# Altium schematic sheet Copy+of+WX0.011.781DL.schdoc
size A2
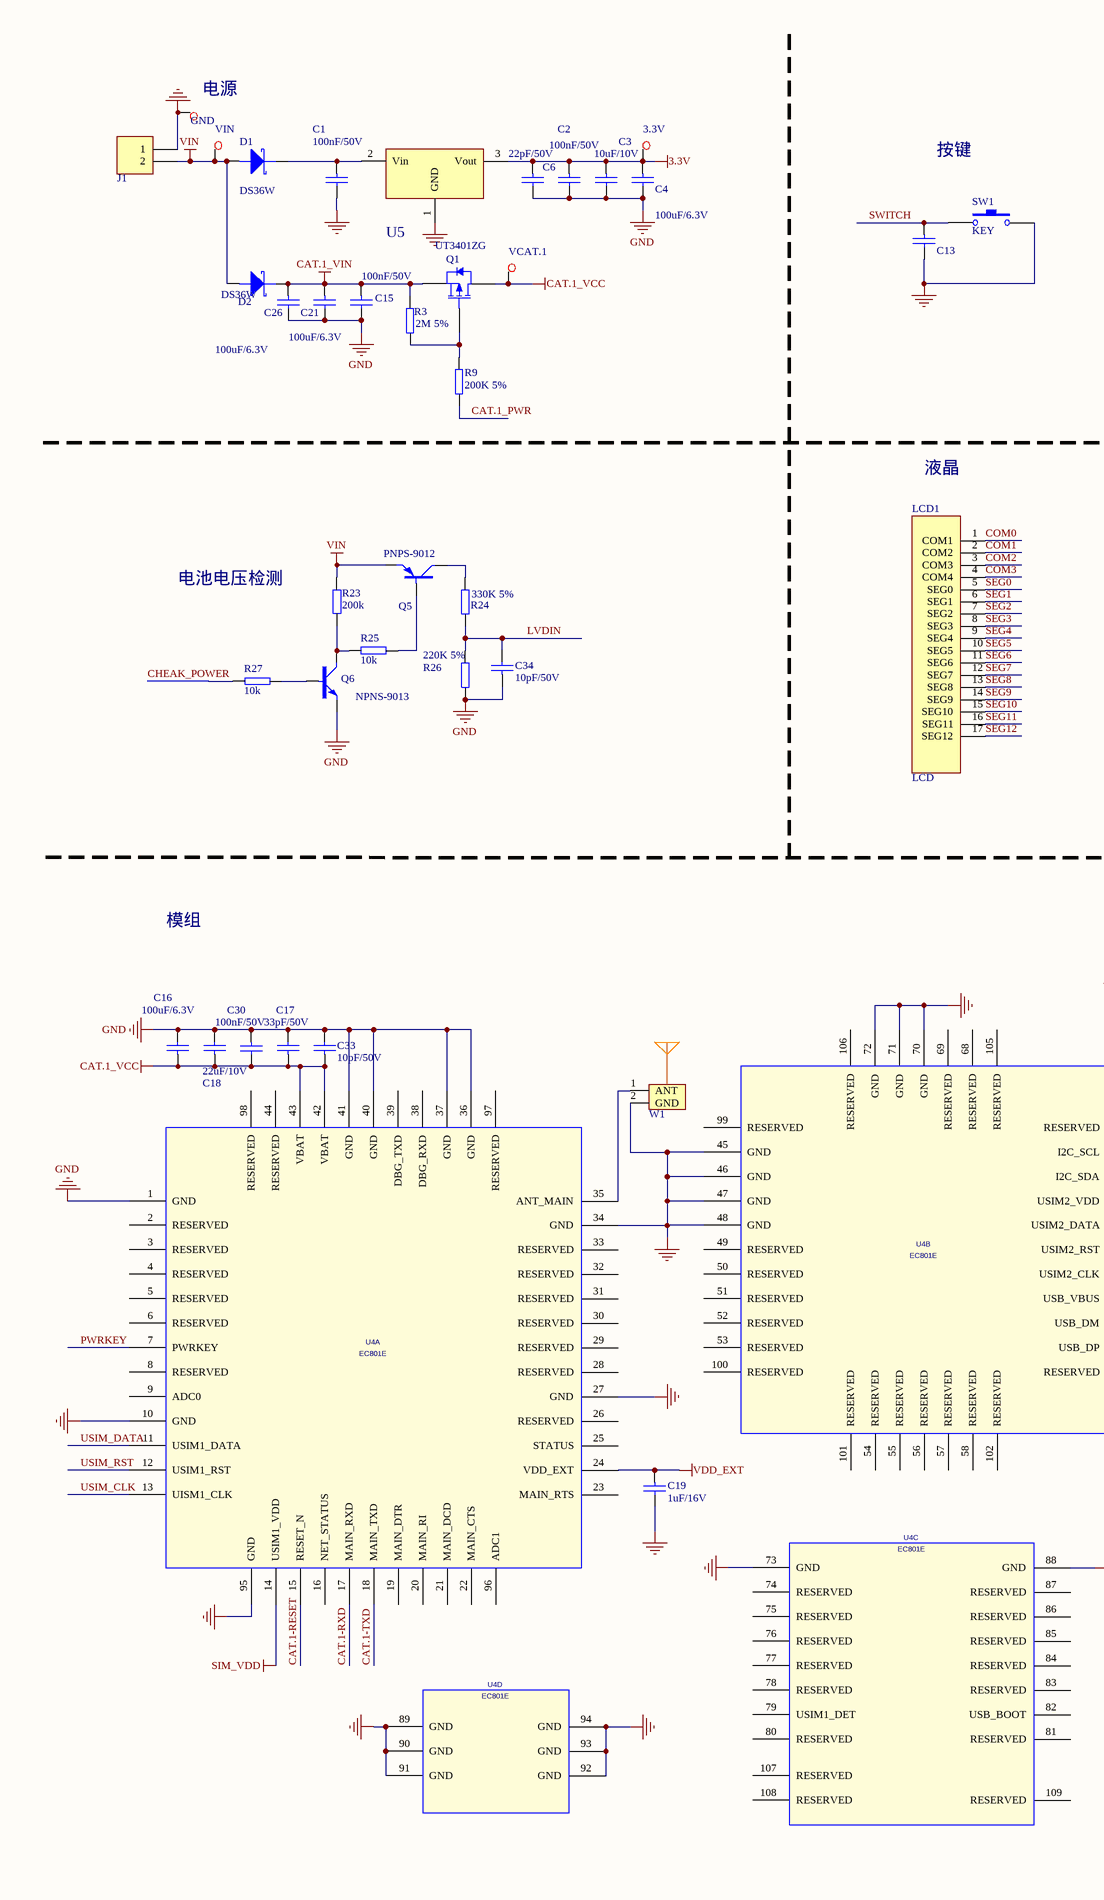
[diagram p0: Copy+of+WX0.011.781DL.schdoc, left]
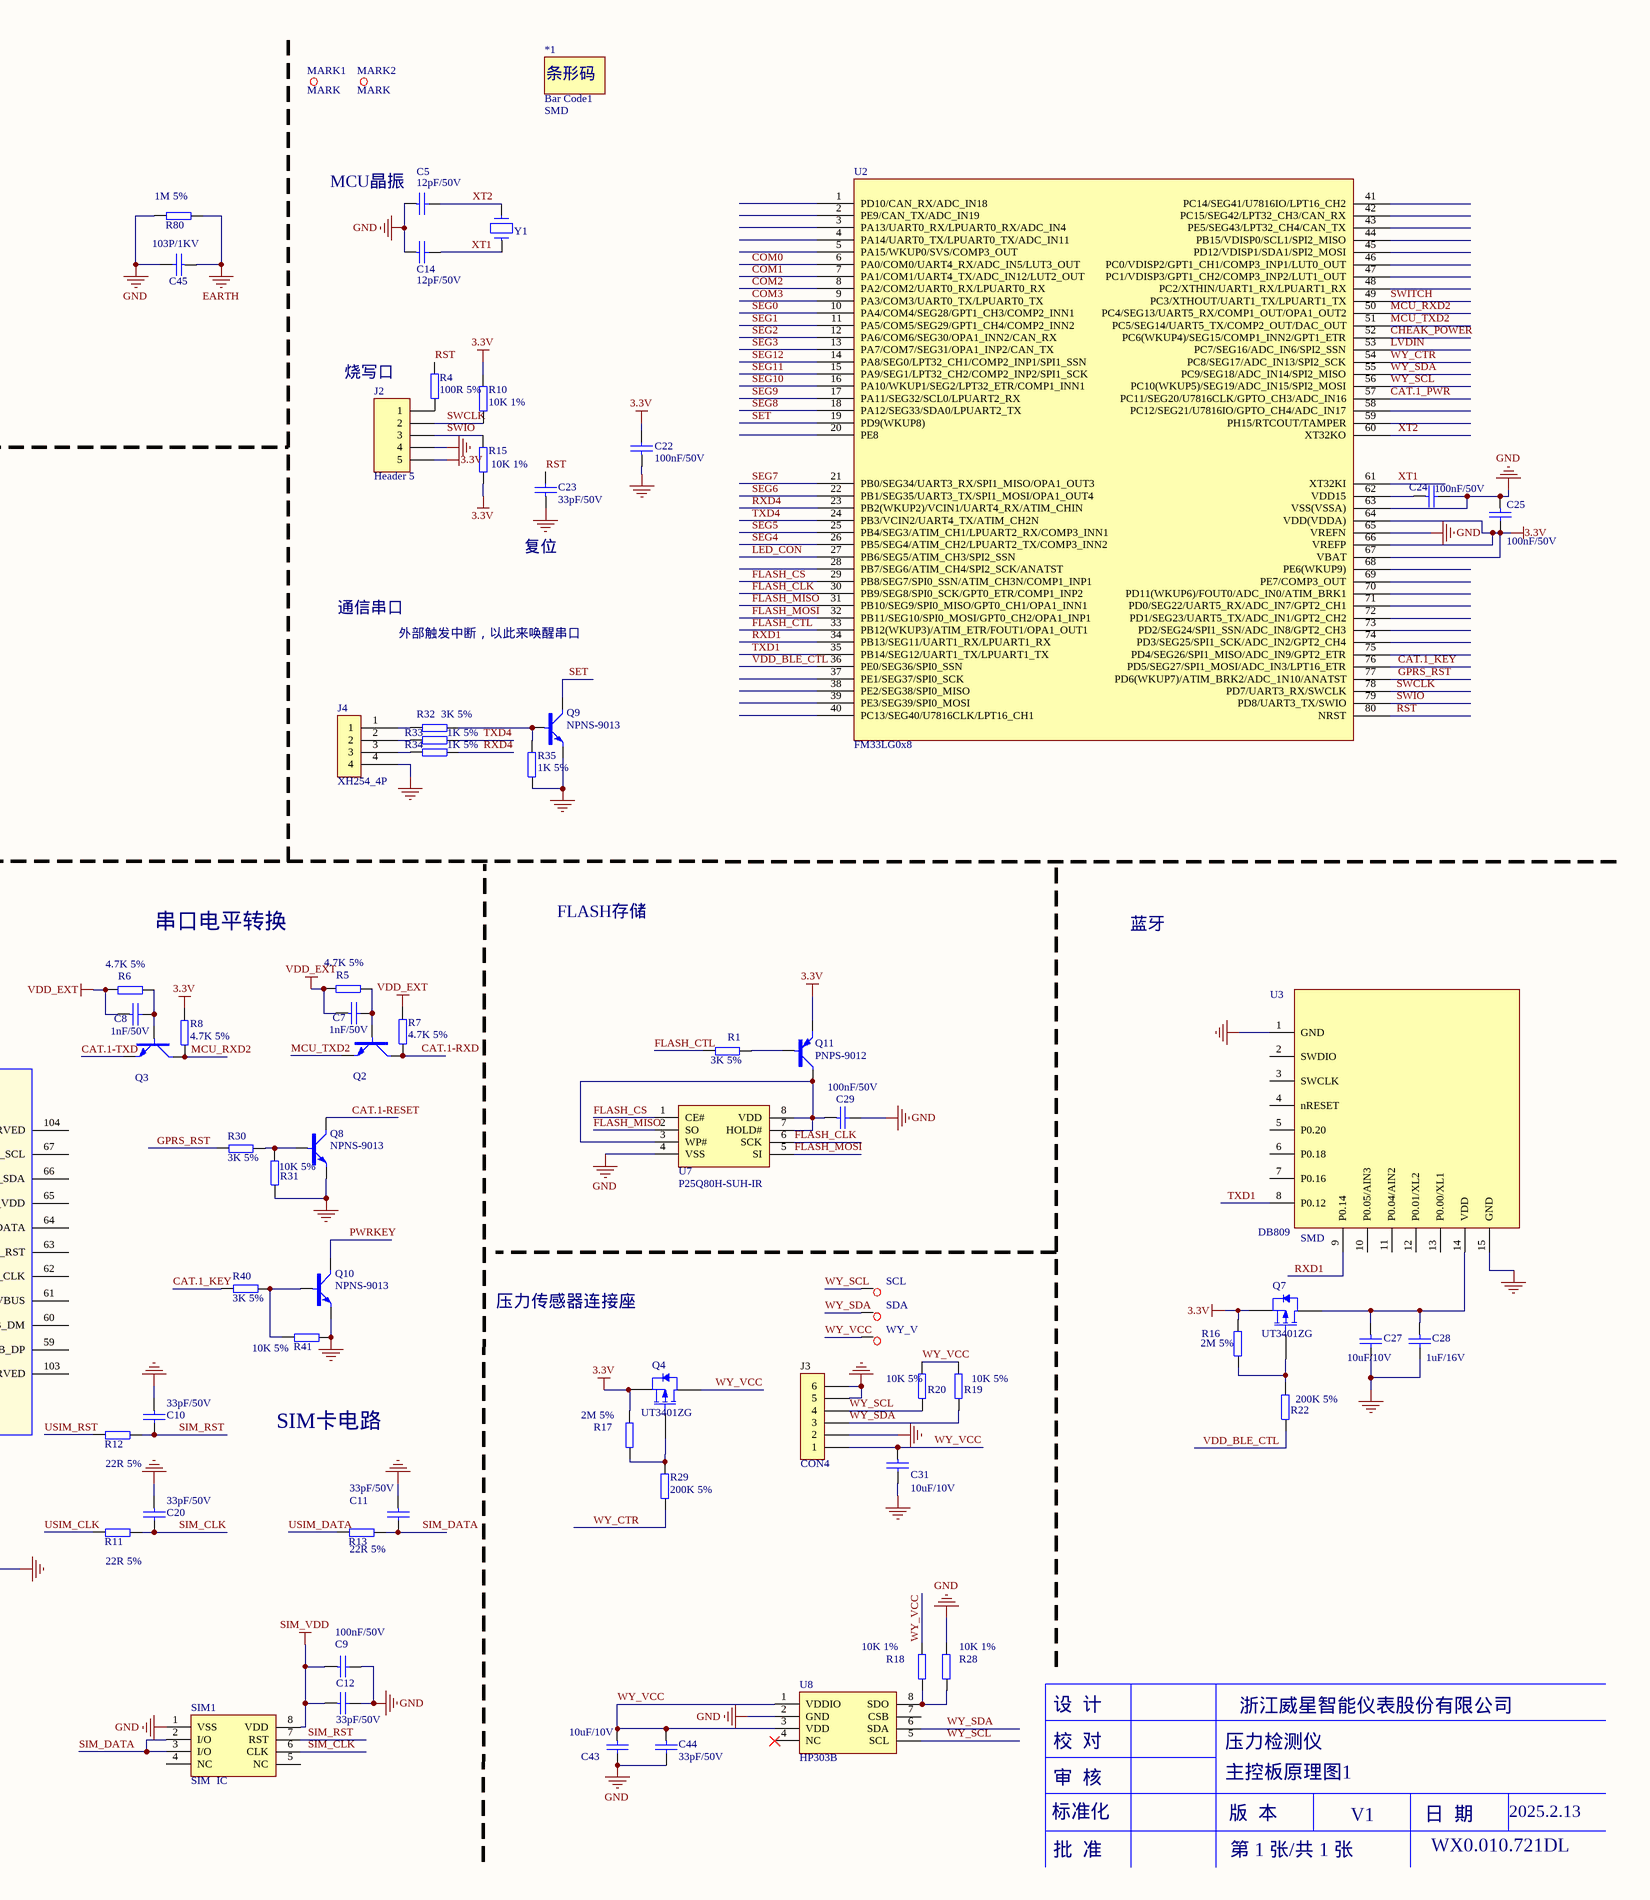
[diagram p1: Copy+of+WX0.011.781DL.schdoc, right]

## Parts
3.3V  TEST-PAD  [TEST-PAD]  (value not drawn)
*1  Bar Code1  SMD/DIP: SMD  [Bar Code1]
C1  100nF/50V  [CAP0603]
C2  100nF/50V  [CAP0603]
C3  10uF/10V  [CAP0603]
C4  100uF/6.3V  [GRM1206]
C5  12pF/50V  [CAP0603]
C6  22pF/50V  [CAP0603]
C7  1nF/50V  [CAP0603]
C8  1nF/50V  [CAP0603]
C9  100nF/50V  [CAP0603]
C10  33pF/50V  [CAP0603]
C11  33pF/50V  [CAP0603]
C12  33pF/50V  [CAP0603]
C13  100nF/50V  [CAP0603]  (value not drawn)
C14  12pF/50V  [CAP0603]
C15  100nF/50V  [CAP0603]
C16  100uF/6.3V  [GRM1206]
C17  33pF/50V  [CAP0603]
C18  22uF/10V  [CAP0805]
C19  1uF/16V  [CAP0603]
C20  33pF/50V  [CAP0603]
C21  100uF/6.3V  [GRM1206]
C22  100nF/50V  [CAP0603]
C23  33pF/50V  [CAP0603]
C24  100nF/50V  [CAP0603]
C25  100nF/50V  [CAP0603]
C26  100uF/6.3V  [GRM1206]
C27  10uF/10V  [CAP0603]
C28  1uF/16V  [CAP0603]
C29  100nF/50V  [CAP0603]
C30  100nF/50V  [CAP0603]
C31  10uF/10V  [CAP0603]
C33  10pF/50V  [CAP0603]
C34  10pF/50V  [CAP0603]
C43  10uF/10V  [CAP0603]
C44  33pF/50V  [CAP0603]
C45  103P/1KV  [CAP1206]
D1  DS36W  [SOD-123FL]
D2  DS36W  [SOD-123FL]
GND  TEST-PAD  [TEST-PAD]  (value not drawn)
J1  Header 2  [VBAT]  (value not drawn)
J2  Header 5  [PIN254_1*5SR]
J3  CON4  [WX-PH-4AB]
J4  XH254_4P  [HDR1X4_2.54]
LCD1  LCD  [JR-H25903AFP]
MARK1  MARK  [MARK]
MARK2  MARK  [MARK]
Q1  UT3401ZG  [SOT-23]
Q2  NPNS-9013  [SOT-23]  (value not drawn)
Q3  NPNS-9013  [SOT-23]  (value not drawn)
Q4  UT3401ZG  [SOT-23]
Q5  PNPS-9012  [SOT-23]
Q6  NPNS-9013  [SOT-23]
Q7  UT3401ZG  [SOT-23]
Q8  NPNS-9013  [SOT-23]
Q9  NPNS-9013  [SOT-23]
Q10  NPNS-9013  [SOT-23]
Q11  PNPS-9012  [SOT-23]
R1  3K 5%  [RES0603]
R3  2M 5%  [RES0603]
R4  100R 5%  [RES0603]
R5  4.7K 5%  [RES0603]
R6  4.7K 5%  [RES0603]
R7  4.7K 5%  [RES0603]
R8  4.7K 5%  [RES0603]
R9  200K 5%  [RES0603]
R10  10K 1%  [RES0603]
R11  22R 5%  [RES0603]
R12  22R 5%  [RES0603]
R13  22R 5%  [RES0603]
R15  10K 1%  [RES0603]
R16  2M 5%  [RES0603]
R17  2M 5%  [RES0603]
R18  10K 1%  [RES0603]
R19  10K 5%  [RES0603]
R20  10K 5%  [RES0603]
R22  200K 5%  [RES0603]
R23  200k  [RES0603]
R24  330K 5%  [RES0603]
R25  10k  [RES0603]
R26  220K 5%  [RES0603]
R27  10k  [RES0603]
R28  10K 1%  [RES0603]
R29  200K 5%  [RES0603]
R30  3K 5%  [RES0603]
R31  10K 5%  [RES0603]
R32  3K 5%  [RES0603]
R33  1K 5%  [RES0603]
R34  1K 5%  [RES0603]
R35  1K 5%  [RES0603]
R40  3K 5%  [RES0603]
R41  10K 5%  [RES0603]
R80  1M 5%  [RES1206]
SCL  TEST-PAD  [TEST-PAD]  (value not drawn)
SDA  TEST-PAD  [TEST-PAD]  (value not drawn)
SIM1  SIM  IC  [SIMIC]
SW1  KEY  [DIP-6X6X8]
U2  FM33LG0x8  [LQFP80]
U3  DB809  SMD/DIP: SMD  [DB809]
U4  EC801E  [EC801E]  (parts A,B,C,D of 4)
U5  CE6232A33P  [SOT-89]  (value not drawn)
U7  P25Q80H-SUH-IR  [SOP-8L-200MIL]
U8  HP303B  [LGA_8]
VCAT.1  TEST-PAD  [TEST-PAD]  (value not drawn)
VIN  TEST-PAD  [TEST-PAD]  (value not drawn)
W1  天线  [ANT-IPEX_1]  (value not drawn)
WY_V  TEST-PAD  [TEST-PAD]  (value not drawn)
Y1  SF32WK32768D71T005  [SMD-3215_2P]  (value not drawn)

## Nets
3.3V: 3.3V.1 C2.1 C3.1 C4.1 C6.1 C22.2 C25.2 J2.5 Q4.2(S) Q7.2(S) Q11.2(E) R8.2 R10.2 R15.1 R16.2 R17.2 U2.64(VDD(VDDA)) U2.66(VREFP) U2.67(VBAT) U5.3(Vout)
CAT.1_VCC: C16.1 C17.1 C18.1 C30.2 C33.1 Q1.3(D) U4.42(VBAT) U4.43(VBAT) VCAT.1.1
CAT.1_VIN: C15.1 C21.1 C26.1 D2.2 Q1.2(S) R3.2
EARTH: C45.1 R80.2
GND: C1.2 C2.2 C3.2 C4.2 C5.1 C6.2 C9.2 C10.1 C11.1 C12.2 C13.2 C14.1 C15.2 C16.2 C17.2 C18.2 C19.2 C20.1 C21.2 C22.1 C23.1 C24.2 C25.1 C26.2 C27.2 C28.2 C29.2 C30.1 C31.2 C33.2 C34.1 C43.2 C44.2 C45.2 GND.1 J1.1 J2.4 J3.2 J3.5 J3.6 J4.4 Q6.2(E) Q8.2(E) Q9.2(E) Q10.2(E) R26.1 R28.2 R31.1 R35.1 R41.2 R80.1 SIM1.1(VSS) SW1.2 U2.63(VSS(VSSA)) U2.65(VREFN) U3.1(GND) U3.15(GND) U4.1(GND) U4.10(GND) U4.27(GND) U4.34(GND) U4.36(GND) U4.37(GND) U4.40(GND) U4.41(GND) U4.45(GND) U4.46(GND) U4.47(GND) U4.48(GND) U4.70(GND) U4.71(GND) U4.72(GND) U4.73(GND) U4.88(GND) U4.89(GND) U4.90(GND) U4.91(GND) U4.92(GND) U4.93(GND) U4.94(GND) U4.95(GND) U5.1(GND) U7.4(VSS) U8.2(GND) W1.2(GND)
SIM_VDD: C9.1 C12.1 SIM1.8(VDD) U4.14(USIM1_VDD)
VDD_EXT: C7.1 C8.1 C19.1 R5.1 R6.1 R7.2 U4.24(VDD_EXT)
VIN: D1.1 D2.1 J1.2 Q5.2(E) R23.2 VIN.1
CAT.1-RESET: Q8.3(C) U4.15(RESET_N)
CAT.1-RXD: Q2.3(C) R7.1 U4.17(MAIN_RXD)
CAT.1-TXD: Q3.2(E) U4.18(MAIN_TXD)
CAT.1_KEY: R40.1 U2.76(PD5/SEG27/SPI1_MOSI/ADC_IN3/LPT16_ETR)
CAT.1_PWR: R9.1 U2.57(PC11/SEG20/U7816CLK/GPTO_CH3/ADC_IN16)
CHEAK_POWER: R27.1 U2.52(PC6(WKUP4)/SEG15/COMP1_INN2/GPT1_ETR)
COM0: LCD1.1(COM1) U2.6(PA0/COM0/UART4_RX/ADC_IN5/LUT3_OUT)
COM1: LCD1.2(COM2) U2.7(PA1/COM1/UART4_TX/ADC_IN12/LUT2_OUT)
COM2: LCD1.3(COM3) U2.8(PA2/COM2/UART0_RX/LPUART0_RX)
COM3: LCD1.4(COM4) U2.9(PA3/COM3/UART0_TX/LPUART0_TX)
FLASH_CLK: U2.30(PB9/SEG8/SPI0_SCK/GPT0_ETR/COMP1_INP2) U7.6(SCK)
FLASH_CS: U2.29(PB8/SEG7/SPI0_SSN/ATIM_CH3N/COMP1_INP1) U7.1(CE#)
FLASH_CTL: R1.1 U2.33(PB12(WKUP3)/ATIM_ETR/FOUT1/OPA1_OUT1)
FLASH_MISO: U2.31(PB10/SEG9/SPI0_MISO/GPT0_CH1/OPA1_INN1) U7.2(SO)
FLASH_MOSI: U2.32(PB11/SEG10/SPI0_MOSI/GPT0_CH2/OPA1_INP1) U7.5(SI)
GPRS_RST: R30.1 U2.77(PD6(WKUP7)/ATIM_BRK2/ADC_1N10/ANATST)
LED_CON: U2.27(PB6/SEG5/ATIM_CH3/SPI2_SSN)
LVDIN: C34.2 R24.1 R26.2 U2.53(PC7/SEG16/ADC_IN6/SPI2_SSN)
MCU_RXD2: Q3.3(C) R8.1 U2.50(PC4/SEG13/UART5_RX/COMP1_OUT/OPA1_OUT2)
MCU_TXD2: Q2.2(E) U2.51(PC5/SEG14/UART5_TX/COMP2_OUT/DAC_OUT)
PWRKEY: Q10.3(C) U4.7(PWRKEY)
RST: C23.2 R4.1 U2.80(NRST)
RXD1: U2.34(PB13/SEG11/UART1_RX/LPUART1_RX) U3.9(P0.14)
RXD4: R34.2 U2.23(PB2(WKUP2)/VCIN1/UART4_RX/ATIM_CHIN)
SEG0: LCD1.5(SEG0) U2.10(PA4/COM4/SEG28/GPT1_CH3/COMP2_INN1)
SEG1: LCD1.6(SEG1) U2.11(PA5/COM5/SEG29/GPT1_CH4/COMP2_INN2)
SEG2: LCD1.7(SEG2) U2.12(PA6/COM6/SEG30/OPA1_INN2/CAN_RX)
SEG3: LCD1.8(SEG3) U2.13(PA7/COM7/SEG31/OPA1_INP2/CAN_TX)
SEG4: LCD1.9(SEG4) U2.26(PB5/SEG4/ATIM_CH2/LPUART2_TX/COMP3_INN2)
SEG5: LCD1.10(SEG5) U2.25(PB4/SEG3/ATIM_CH1/LPUART2_RX/COMP3_INN1)
SEG6: LCD1.11(SEG6) U2.22(PB1/SEG35/UART3_TX/SPI1_MOSI/OPA1_OUT4)
SEG7: LCD1.12(SEG7) U2.21(PB0/SEG34/UART3_RX/SPI1_MISO/OPA1_OUT3)
SEG8: LCD1.13(SEG8) U2.18(PA12/SEG33/SDA0/LPUART2_TX)
SEG9: LCD1.14(SEG9) U2.17(PA11/SEG32/SCL0/LPUART2_RX)
SEG10: LCD1.15(SEG10) U2.16(PA10/WKUP1/SEG2/LPT32_ETR/COMP1_INN1)
SEG11: LCD1.16(SEG11) U2.15(PA9/SEG1/LPT32_CH2/COMP2_INP2/SPI1_SCK)
SEG12: LCD1.17(SEG12) U2.14(PA8/SEG0/LPT32_CH1/COMP2_INP1/SPI1_SSN)
SET: Q9.3(C) U2.19(PD9(WKUP8))
SIM_CLK: C20.2 R11.2 SIM1.6(CLK)
SIM_DATA: C11.2 R13.2 SIM1.2(I/O) SIM1.3(I/O)
SIM_RST: C10.2 R12.2 SIM1.7(RST)
SWCLK: J2.2 R10.1 U2.78(PD7/UART3_RX/SWCLK)
SWIO: J2.3 R15.2 U2.79(PD8/UART3_TX/SWIO)
SWITCH: C13.1 SW1.1 U2.49(PC3/XTHOUT/UART1_TX/LPUART1_TX)
TXD1: U2.35(PB14/SEG12/UART1_TX/LPUART1_TX) U3.8(P0.12)
TXD4: R33.2 U2.24(PB3/VCIN2/UART4_TX/ATIM_CH2N)
USIM_CLK: R11.1 U4.13(UISM1_CLK)
USIM_DATA: R13.1 U4.11(USIM1_DATA)
USIM_RST: R12.1 U4.12(USIM1_RST)
VDD_BLE_CTL: R22.1 U2.36(PE0/SEG36/SPI0_SSN)
WY_CTR: R29.1 U2.54(PC8/SEG17/ADC_IN13/SPI2_SCK)
WY_SCL: J3.4 R20.1 SCL.1 U2.56(PC10(WKUP5)/SEG19/ADC_IN15/SPI2_MOSI) U8.5(SCL)
WY_SDA: J3.3 R19.1 SDA.1 U2.55(PC9/SEG18/ADC_IN14/SPI2_MISO) U8.6(SDA)
WY_VCC: C31.1 C43.1 C44.1 J3.1 Q4.3(D) R18.2 R19.2 R20.2 U8.1(VDDIO) U8.3(VDD) WY_V.1
XT1: C14.2 U2.61(XT32KI) Y1.1
XT2: C5.2 U2.60(XT32KO) Y1.2
NetC1_1: C1.1 D1.2 U5.2(Vin)
NetC7_2: C7.2 Q2.1(B) R5.2
NetC8_2: C8.2 Q3.1(B) R6.2
NetC24_1: C24.1 U2.62(VDD15)
NetC27_1: C27.1 C28.1 Q7.3(D) U3.14(VDD)
NetC29_1: C29.1 Q11.3(C) U7.3(WP#) U7.7(HOLD#) U7.8(VDD)
NetJ2_1: J2.1 R4.2
NetJ4_1: J4.1 R32.1
NetJ4_2: J4.2 R33.1
NetJ4_3: J4.3 R34.1
NetQ1_1: Q1.1(G) R3.1 R9.2
NetQ4_1: Q4.1(G) R17.1 R29.2
NetQ5_1: Q5.1(B) R25.2
NetQ5_3: Q5.3(C) R24.2
NetQ6_1: Q6.1(B) R27.2
NetQ6_3: Q6.3(C) R23.1 R25.1
NetQ7_1: Q7.1(G) R16.1 R22.2
NetQ8_1: Q8.1(B) R30.2 R31.2
NetQ9_1: Q9.1(B) R32.2 R35.2
NetQ10_1: Q10.1(B) R40.2 R41.1
NetQ11_1: Q11.1(B) R1.2
NetR18_1: R18.1 R28.1 U8.8(SDO)
NetU4_35: U4.35(ANT_MAIN) W1.1(ANT)

Not connected (* = marked no-connect by the designer): SIM1 4(NC) 5(NC); U2 1(PD10/CAN_RX/ADC_IN18) 2(PE9/CAN_TX/ADC_IN19) 3(PA13/UART0_RX/LPUART0_RX/ADC_IN4) 4(PA14/UART0_TX/LPUART0_TX/ADC_IN11) 5(PA15/WKUP0/SVS/COMP3_OUT) 20(PE8) 28(PB7/SEG6/ATIM_CH4/SPI2_SCK/ANATST) 37(PE1/SEG37/SPI0_SCK) 38(PE2/SEG38/SPI0_MISO) 39(PE3/SEG39/SPI0_MOSI) 40(PC13/SEG40/U7816CLK/LPT16_CH1) 41(PC14/SEG41/U7816IO/LPT16_CH2) 42(PC15/SEG42/LPT32_CH3/CAN_RX) 43(PE5/SEG43/LPT32_CH4/CAN_TX) 44(PB15/VDISP0/SCL1/SPI2_MISO) 45(PD12/VDISP1/SDA1/SPI2_MOSI) 46(PC0/VDISP2/GPT1_CH1/COMP3_INP1/LUT0_OUT) 47(PC1/VDISP3/GPT1_CH2/COMP3_INP2/LUT1_OUT) 48(PC2/XTHIN/UART1_RX/LPUART1_RX) 58(PC12/SEG21/U7816IO/GPTO_CH4/ADC_IN17) 59(PH15/RTCOUT/TAMPER) 68(PE6(WKUP9)) 69(PE7/COMP3_OUT) 70(PD11(WKUP6)/FOUT0/ADC_IN0/ATIM_BRK1) 71(PD0/SEG22/UART5_RX/ADC_IN7/GPT2_CH1) 72(PD1/SEG23/UART5_TX/ADC_IN1/GPT2_CH2) 73(PD2/SEG24/SPI1_SSN/ADC_IN8/GPT2_CH3) 74(PD3/SEG25/SPI1_SCK/ADC_IN2/GPT2_CH4) 75(PD4/SEG26/SPI1_MISO/ADC_IN9/GPT2_ETR); U3 2(SWDIO) 3(SWCLK) 4(nRESET) 5(P0.20) 6(P0.18) 7(P0.16) 10(P0.05/AIN3) 11(P0.04/AIN2) 12(P0.01/XL2) 13(P0.00/XL1); U4 2(RESERVED) 3(RESERVED) 4(RESERVED) 5(RESERVED) 6(RESERVED) 8(RESERVED) 9(ADC0) 16(NET_STATUS) 19(MAIN_DTR) 20(MAIN_RI) 21(MAIN_DCD) 22(MAIN_CTS) 23(MAIN_RTS) 25(STATUS) 26(RESERVED) 28(RESERVED) 29(RESERVED) 30(RESERVED) 31(RESERVED) 32(RESERVED) 33(RESERVED) 38(DBG_RXD) 39(DBG_TXD) 44(RESERVED) 49(RESERVED) 50(RESERVED) 51(RESERVED) 52(RESERVED) 53(RESERVED) 54(RESERVED) 55(RESERVED) 56(RESERVED) 57(RESERVED) 58(RESERVED) 59(USB_DP) 60(USB_DM) 61(USB_VBUS) 62(USIM2_CLK) 63(USIM2_RST) 64(USIM2_DATA) 65(USIM2_VDD) 66(I2C_SDA) 67(I2C_SCL) 68(RESERVED) 69(RESERVED) 74(RESERVED) 75(RESERVED) 76(RESERVED) 77(RESERVED) 78(RESERVED) 79(USIM1_DET) 80(RESERVED) 81(RESERVED) 82(USB_BOOT) 83(RESERVED) 84(RESERVED) 85(RESERVED) 86(RESERVED) 87(RESERVED) 96(ADC1) 97(RESERVED) 98(RESERVED) 99(RESERVED) 100(RESERVED) 101(RESERVED) 102(RESERVED) 103(RESERVED) 104(RESERVED) 105(RESERVED) 106(RESERVED) 107(RESERVED) 108(RESERVED) 109(RESERVED); U8 4(NC)* 7(CSB)

## Notes on the sheet
- (near GND) 电源
- 按键
- (near C5) MCU晶振
- 烧写口
- 液晶
- 电池电压检测
- (near C23) 复位
- 通信串口
- 外部触发中断，以此来唤醒串口
- 模组
- 串口电平转换
- FLASH存储
- 蓝牙
- 压力传感器连接座
- SIM卡电路
- 设  计
- 校  对
- 压力检测仪
- 浙江威星智能仪表股份有限公司
- 审  核
- 主控板原理图1
- 标准化
- 批  准
- 版  本
- 第 1 张/共 1 张
- V1
- 日  期
- WX0.010.721DL
- 2025.2.13

## Library data of the parts
3.3V GND SCL SDA VCAT.1 VIN WY_V = AD_WXHJ_TEST-PAD_01: 单面焊盘测试点; Part Name: 测试点; ID: 23; SMD/DIP: SMD; Part Number: AD_WXHJ_TEST-PAD_01
*1 = AD_WXHJ_Bar Code_02: 条形码 ,填充，无需焊接器件; ID: 17; Part Number: AD_WXHJ_Bar Code_02; Part Name: 条形码
C1 C2 C9 C13 C15 C22 C24 C25 C29 C30 = 101020103-0021: 104pF,50 V,±10%,0603,国巨,CC0603KRX7R9BB104; Part Name: 0603贴片电容; ID: 3; SMD/DIP: SMD; Part Number: 101020103-0021
C3 C27 C31 C43 = 101020103-0026: 106pF,10 V,±10%,0603,村田,GRM188R61A106KE47D; Part Name: 0603贴片电容; ID: 8; SMD/DIP: SMD; Part Number: 101020103-0026
C4 C16 C21 C26 = 101020101-0020: 100uF,6.3 V,±20%,1206,村田,GRM31CR60J107ME39L; Part Name: 贴片电容; ID: 27; SMD/DIP: SMD; Part Number: 101020101-0020
C5 C14 = 101020103-0005: 12P,50 V,±5%,0603,国巨,CC0603JRNPO9BN12; Part Name: 0603贴片电容; ID: 11; SMD/DIP: SMD; Part Number: 101020103-0005
C6 = 101020103-0009: 22pF,50 V,±5%,0603,国巨,CC0603JRNPO9BN22; Part Name: 0603贴片电容; ID: 16; SMD/DIP: SMD; Part Number: 101020103-0009
C7 C8 = 101020103-0022: 102pF,50 V,±10%,0603,国巨,CC0603KRX7R9BB102; Part Name: 0603贴片电容; ID: 13; SMD/DIP: SMD; Part Number: 101020103-0022
C10-C12 C17 C20 C23 C44 = 101020103-0027: 33pF,50 V,±10%,0603,国巨,CC0603KRNPO9BN33; Part Name: 0603贴片电容; ID: 17; SMD/DIP: SMD; Part Number: 101020103-0027
C18 = 101020102-0012: 226P,10 V,±20%,0805,村田电子有限公司,GRM21BR61A226ME51L; Part Name: 贴片电容; ID: 20; SMD/DIP: SMD; Part Number: 101020102-0012
C19 C28 = 101020103-0003: 105pF,16 V,±10%,0603,国巨,CC0603KRX7R7BB105; Part Name: 0603贴片电容; ID: 14; SMD/DIP: SMD; Part Number: 101020103-0003
C33 C34 = 101020103-0014: 10pF,50 V,±5%,0603,X7R,国巨,CC0603JRNPO9BN100; Part Name: 0603贴片电容; ID: 7; SMD/DIP: SMD; Part Number: 101020103-0014
C45 = 101020103-0021: 103P/1KV,±10％,1206; Part Number: 101020101-0003; Part Name: 1206贴片电容; ID: 3; SMD/DIP: SMD
D1 D2 = 101040101-0055: DS36W,SOD123-FL,3 A,42 V,60 V,浙江领晨科技有限公司,DS36W; Part Name: 贴片肖特基; ID: 40; SMD/DIP: SMD; Part Number: 101040101-0055
J1 = Header 2: Header, 2-Pin
J2 = Header 5: Header, 5-Pin
J3 = CON4: Connector; MFR PN: *; MFR: *; AUPU PN: *; Level: *; Value1: *; Value2: *; Safty: *; Sub SYS: *; Price: *; MOQ: *; MPQ: *; LT: *
J4 = 90003: 单排插针，4PIN,间距2.54mm; Part Number: 90003; Part Name: 单排插针; ID: 12
LCD1 = LCDSH
MARK1 MARK2 = AD_WXHJ_MARK_01: MARK点; ID: 8; SMD/DIP: SMD; Part Number: AD_WXHJ_MARK_01; Part Name: MARK点
Q1 Q4 Q7 = 101040201-0013: UT3401ZG,P-MOS,SOT-23,UTC,UT3401ZG; Part Name: 功率MOS管; ID: 18; SMD/DIP: SMD; Part Number: 101040201-0013
Q2 Q3 Q6 = 101040201-0002: 9013,NPN,SOT-23,长电,S9013; Part Name: 贴片三极管; ID: 15; SMD/DIP: SMD; Part Number: 101040201-0002
Q5 = 101040201-0001: 9012,PNP,SOT-23,JCET;长电,S9012; Part Name: 贴片三极管; ID: 17; SMD/DIP: SMD; Part Number: 101040201-0001
Q8-Q10 = 101040201-0002: 9013,NPN,SOT-23,长电,S9013; Part Name: 贴片三极管; ID: 14; SMD/DIP: SMD; Part Number: 101040201-0002
Q11 = 101040201-0001: 9012,PNP,SOT-23,JCET;长电,S9012; Part Name: 贴片三极管; ID: 16; SMD/DIP: SMD; Part Number: 101040201-0001
R1 R30 = 101010103-0006: 国巨,±5%,0603,,155 ℃,-55 ℃,RC0603JR-073KL,无铅,100 ppm/℃,1/10W,,3K; Part Name: 0603贴片电阻; ID: 22; SMD/DIP: SMD; Part Number: 101010103-0006
R3 R16 R17 = 101010103-0025: 国巨,±5%,0603,,155 ℃,-55 ℃,RC0603JR-072ML,含铅,100 ppm/℃,1/10W,,2M; Part Name: 0603贴片电阻; ID: 20; SMD/DIP: SMD; Part Number: 101010103-0025
R4 = 101010103-0022: 100R,±5%,1/10W,0603,国巨,RC0603JR-07100RL; Part Name: 0603贴片电阻; ID: 5; SMD/DIP: SMD; Part Number: 101010103-0022
R5-R8 = 101010103-0042: 4.7K±5%,1/10W,0603; Part Name: 0603贴片电阻; ID: 24; SMD/DIP: SMD; Part Number: 101010103-0042
R9 R22 = 101010103-0034: 200K,±5%,1/10W,0603,国巨,RC0603JR-07200KL; Part Name: 0603贴片电阻; ID: 13; SMD/DIP: SMD; Part Number: 101010103-0034
R10 R15 R18 R28 = 101010103-0052: 10K±1%,1/10W,0603; Part Name: 0603贴片电阻; ID: 6; SMD/DIP: SMD; Part Number: 101010103-0052
R11-R13 = 101010103-0009: 国巨,±5%,0603,,155 ℃,-55 ℃,RC0603JR-0722RL,无铅,200 ppm/℃,1/10W,,22欧; Part Name: 0603贴片电阻; ID: 18; SMD/DIP: SMD; Part Number: 101010103-0009
R19 R20 R31 R41 = 101010103-0003: 国巨,±5%,0603,,155 ℃,-55 ℃,RC0603JR-0710KL,无铅,200 ppm/℃,1/10W,,10K; Part Name: 0603贴片电阻; ID: 7; SMD/DIP: SMD; Part Number: 101010103-0003
R23 R25 R27 = RES
R24 = 101010103-0066: 330K,±5%,1/10W,0603,国巨,RC0603JR-07330KL; Part Name: 0603贴片电阻; ID: 30; SMD/DIP: SMD; Part Number: 101010103-0066
R26 = 101010103-0044: 220K,±5%,1/10W,0603,国巨,RC0603JR-07220KL; Part Name: 0603贴片电阻; ID: 31; SMD/DIP: SMD; Part Number: 101010103-0044
R29 = 101010103-0003: 10K±5%,1/10W,0603; Part Name: 0603贴片电阻; ID: 32; Part Number: 101010103-0003
R32-R34 R40 = 101010103-0006: 3K±5%,1/10W,0603; Part Name: 0603贴片电阻; ID: 56; Part Number: 101010103-0006
R35 = 101010103-0004: 20K±5%,1/10W,0603; Part Name: 0603贴片电阻; ID: 43; Part Number: 101010103-0004
R80 = 101010103-0002: 国巨,±5%,0603,,155 ℃,-55 ℃,RC0603JR-071ML,无铅,200 ppm/℃,1/10W,,1M; Part Name: 0603贴片电阻; ID: 11; SMD/DIP: SMD; Part Number: 101010103-0002
SIM1 = SIMCARD_1
SW1 = SW-PB: Switch
U3 = 1011402-0194: 北高智蓝牙模块DB809; Part Name: 蓝牙模块; ID: 15; Part Number: 1011402-0194
U4 = EC801E: EC801E Moudle 109PIN 17.7X15.8mm H2.4mm RO; Manufacturer: QUECTEL; Geometry.Height: 2.4mm; Part Description: EC801E Moudle 109PIN 17.7X15.8mm H2.4mm RO; Value: EC801E
U5 = 1010503-0029: CE6232-3.3,CE6232-3.3,SOT89-3,8V,1.8V,0.11V,3.3V,300mA,0.8uA,南京芯力微电子有限公司; Part Name: 线性稳压芯片; ID: 5; SMD/DIP: SMD; Part Number: 1010503-0029
U7 = 101050101-0218: P25Q80H-SUH-IR,SOP8208mil,普冉半导体（上海）股份有限公司,P25Q80H-SUH-IR; Part Name: 贴片存储芯片FLASH; ID: 35; SMD/DIP: SMD; Part Number: 101050101-0218
U8 = HP303B: 1: 1011301-0022
W1 = 1010902-0145: UB06000058A,3*3.1*1.25mm,公头,单排,IPEX一代板端; Part Name: IPEX座; ID: 31; SMD/DIP: SMD; Part Number: 1010902-0145
Y1 = 1010601-0020: SF32WK32768D71T005,3215,32.768kHz,-0.03 ppm/℃,无源,湖北泰晶电子科技股份有限公司,SF32WK32768D71T005; Part Name: 贴片晶振; ID: 45; SMD/DIP: SMD; Part Number: 1010601-0020